# Altium schematic sheet LiPo_Charger.SchDoc: LiPo Charger
size 431 x 279 mm; ApprovedBy: Wuji Zhang; CheckedBy: Wuji Zhang; Author: Wuji Zhang; CompanyName: Upenn; DrawnBy: Wuji Zhang; Engineer: Wuji Zhang; Organization: ORGANIZATION; Address1: ADDRESS 1; Address2: ADDRESS 2; Address3: ADDRESS 3; Address4: ADDRESS 4; Revision: -; SheetNumber: 7; SheetTotal: 8; ENG_APP_DATE: --/--/--; DSN_APP_DATE: --/--/--; CHK_APP_DATE: --/--/--
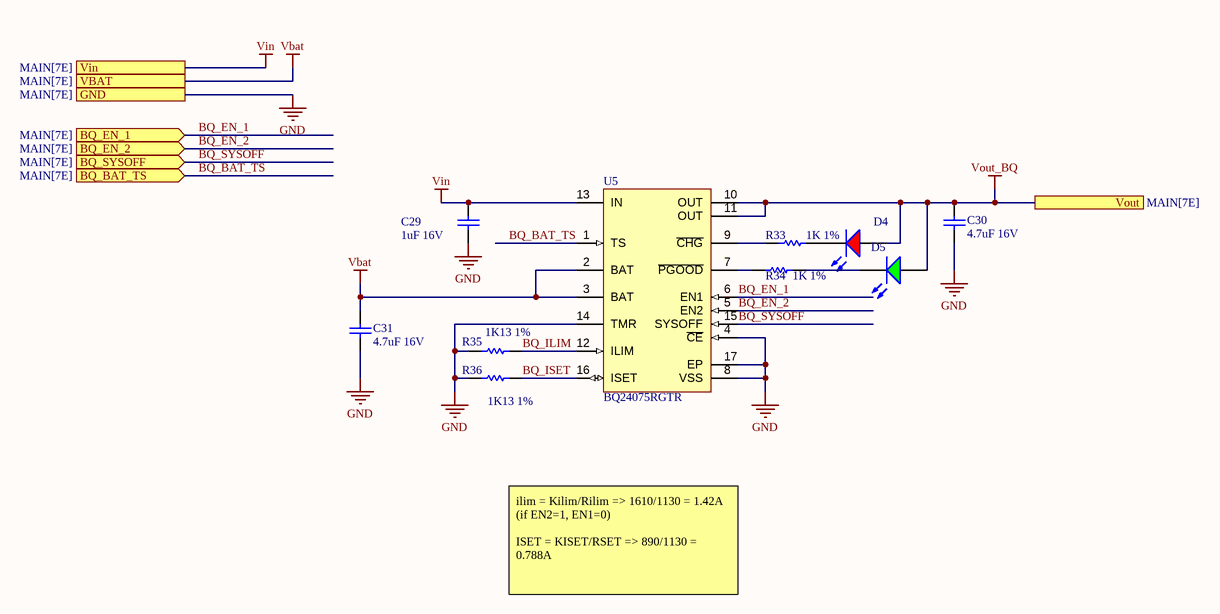
[diagram p0: LiPo_Charger.SchDoc]

## Parts
C29  1uF 16V  [CAPC0603(1608)100_N]
C30  4.7uF 16V  [CAPC0805(2012)145_N]
C31  4.7uF 16V  [CAPC0805(2012)145_N]
D4  LTST-C170CKT  [LTST-C170CKT_V]  (value not drawn)
D5  LTST-C170GKT  [LTST-C170GKT_V]  (value not drawn)
R33  1K 1%  [RESC0603(1608)_N]
R34  1K 1%  [RESC0603(1608)_N]
R35  1K13 1%  [RESC0603(1608)_N]
R36  1K13 1%  [RESC0603(1608)_N]
U5  BQ24075RGTR  [RGT0016C_V]

## Ports
BQ_BAT_TS (in, see MAIN[7E]), BQ_EN_1 (in, see MAIN[7E]), BQ_EN_2 (in, see MAIN[7E]), BQ_SYSOFF (in, see MAIN[7E]), GND (see MAIN[7E]), VBAT (see MAIN[7E]), Vin (see MAIN[7E]), Vout (see MAIN[7E])

## Nets
GND: C29.1 C30.1 C31.2 R35.1 R36.1 U5.4(~{CE}) U5.8(VSS) U5.14(TMR) U5.17(EP) ; port GND
Vbat: C31.1 U5.2(BAT) U5.3(BAT) ; port VBAT
Vin: C29.2 U5.13(IN) ; port Vin
Vout_BQ: C30.2 D4.1(A) D5.1(A) U5.10(OUT) U5.11(OUT) ; port Vout
BQ_BAT_TS: U5.1(TS) ; port BQ_BAT_TS
BQ_EN_1: U5.6(EN1) ; port BQ_EN_1
BQ_EN_2: U5.5(EN2) ; port BQ_EN_2
BQ_ILIM: R35.2 U5.12(ILIM)
BQ_ISET: R36.2 U5.16(ISET)
BQ_SYSOFF: U5.15(SYSOFF) ; port BQ_SYSOFF
NetD4_2: D4.2(K) R33.2
NetD5_2: D5.2(K) R34.2
NetR33_1: R33.1 U5.9(~{CHG})
NetR34_1: R34.1 U5.7(~{PGOOD})

## Notes on the sheet
- ilim = Kilim/Rilim => 1610/1130 = 1.42A (if EN2=1, EN1=0)
  ISET = KISET/RSET => 890/1130 = 0.788A
- DWG. NO.
- REV.
- SHT.
- THIS DOCUMENT AND THE DATA DISCLOSED HEREIN OR HEREWITH IS THE PROPERTY OF ALTIUM LIMITED AND MAY BE FREELY DISTRIBUTED IN WHOLE. NO RIGHTS ARE RESERVED OR EXPRESS OR IMPLIED WARANTEE GIVEN.
- REVISION
- DESCRIPTION
- DATE
- APPROVED
- ENG:
- APPROVALS
- PROJECT
- DSN:
- CHK:
- REFERENCE DOCUMENTS
- PROJECT REVISION:
- TITLE
- DOCUMENT REVISION:
- DESIGN ITEM:
- BOM:
- FAB DWG:
- PCB DWG:
- ASSY DWG:
- SCALE:
- SIZE
- B
- CAGE CODE
- FILE NAME
- DWG NO.
- SHEET
- OF
- REV

## Library data of the parts
C29 = CMP-1035-02736-1: CAP 1uF 16V ±5% 0603 (1608 Metric) Thickness 1mm SMD; Case-Metric: 1608; Case-EIA: 0603; Tolerance: Â±5%; Technology: SMT; Max Thickness: 1 mm; Rated Voltage: 16 V; Value: 1uF
C30 C31 = CMP-1036-04893-1: CAP 4.7uF 16V -20% to +80% 0805 (2012 Metric) Thickness 1.45mm SMD; Case-Metric: 2012; Case-EIA: 0805; Max Thickness: 1.45 mm; Value: 4.7uF; Rated Voltage: 16 V; Tolerance: -20% to +80%; Technology: SMT
D4 = CMP-1674-00001-5: LED Uni-Color Red, 100 mW, 200 mA, -55 to 85 degC, 2-Pin SMD, RoHS, Tape and Reel; Manufacturer: Lite-On; PackageReference: C170CKT; ComponentLink1Description: Manufacturer URL; ComponentLink1URL: http://www.us.liteon.com/; Package Quantity: 3000; Packaging: Tape and Reel; Pins: 2; ComponentLink2URL: http://media.digikey.com/pdf/Data%20Sheets/Lite-On%20PDFs/LTST-C170CKT.pdf; Max Operating Temperature: 85 degC; Min Operating Temperature: -55 degC; Mounting Technology: Surface Mount; Mount: Surface Mount; Length: 2 mm; ComponentLink2Description: Datasheet; DatasheetVersion: 03/2003; Height: 1.1 mm; PackageDescription: 2-Pin Surface Mount Device, Body 2 x 1.25 mm; RoHSCompliant: true; Colour: Red
D5 = CMP-1674-00002-5: LED Uni-Color Green, 100 mW, 120 mA, -55 to 85 degC, 2-Pin SMD, RoHS, Tape and Reel; Manufacturer: Lite-On; PackageReference: C170GKT; ComponentLink1Description: Manufacturer URL; ComponentLink1URL: http://www.us.liteon.com/; Height: 1.1 mm; PackageDescription: 2-Pin Surface Mount Device, Body 2 x 1.25 mm; RoHSCompliant: true; Package Quantity: 1; Packaging: Tape and Reel; Mount: Surface Mount; Min Operating Temperature: -55 degC; DatasheetVersion: 03/2003; Max Operating Temperature: 85 degC; Pins: 2; Mounting Technology: Surface Mount; Length: 2 mm; Colour: Green; ComponentLink2URL: http://media.digikey.com/pdf/Data%20Sheets/Lite-On%20PDFs/LTST-C170GKT.pdf; ComponentLink2Description: Datasheet
R33 R34 = CMP-1012-00510-1: 1K 0.1W 1% 0603 (1608 Metric)  SMD; Case-Metric: 1608; Case-EIA: 0603; Value: 1000.00 Ohm; Technology: SMT; Tolerance: 1 %; Power: 0.1 W
R35 R36 = CMP-1012-00515-1: 1K13 0.1W 1% 0603 (1608 Metric)  SMD; Value: 1130.00 Ohm; Case-EIA: 0603; Case-Metric: 1608; Power: 0.1 W; Tolerance: 1 %; Technology: SMT
U5 = CMP-0321-00238-2: USB-Friendly Li-Ion Battery Charger and Power-Path Management IC, Vout 5.5 V, 4.3 V, -40 to 85 degC, 16-pin QFN (RGT), Green (RoHS & no Sb/Br); Manufacturer: Texas Instruments; SubFamily: Battery Charge Management; NiCd: N; Vin(Min)(V): 4.3; Mounting Technology: Surface Mount; PackageDescription: 16-Pin Plastic Quad Flat No-Lead, 3 x 3 mm Body, 0.5 mm Pitch, 1.7 x 1.7 mm Exposed Pad; Over Voltage Protection: N; Code_JEDEC: MO-220; Li-Ion: N; Eco-Plan: Green (RoHS & no Sb/Br); DatasheetVersion: SLUS810G; PackageVersion: revH, Oct-2011; PartNumber: BQ24075RGTR; PackageReference: RGT0016C; ComponentLink1URL: http://www.ti.com/general/docs/lit/getliterature.tsp?genericPartNumber=BQ24075&fileType=pdf; Lead Acid: N; ComponentLink1Description: Datasheet; Li-Polymer: N; NiMH: N